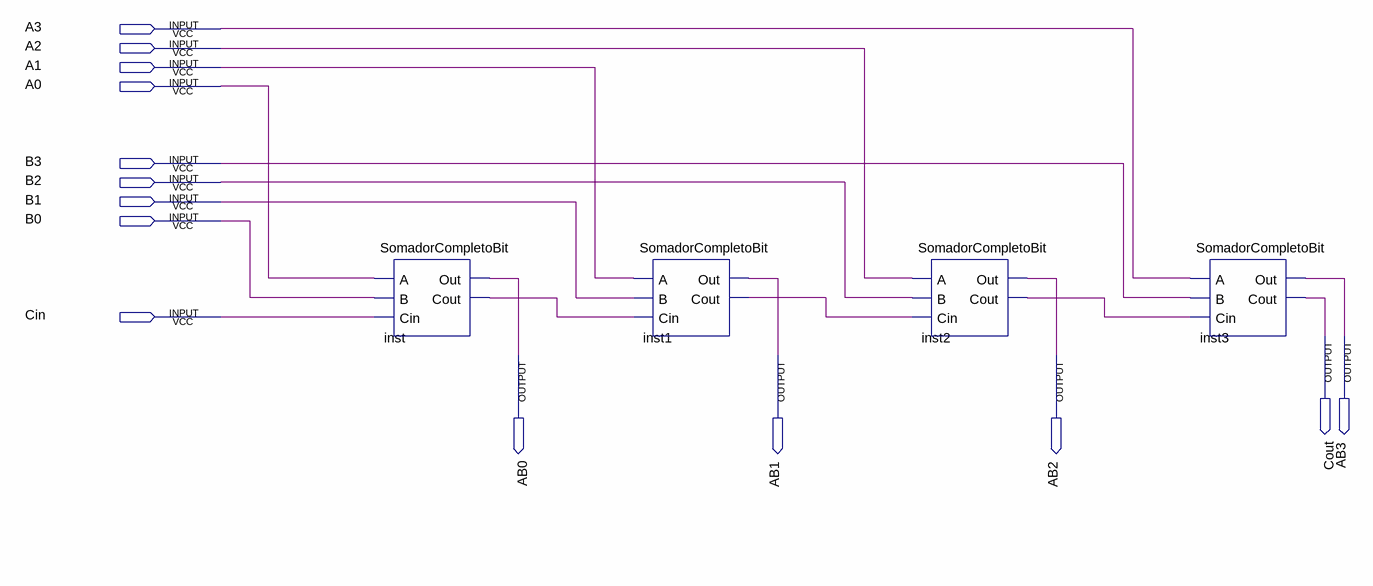
[diagram p0: schematic sheet]
// Quartus schematic SomadorCompleto.bdf as structural Verilog: 4 symbols, 14 pins
module SomadorCompleto (
  input  A3,
  input  A2,
  input  A1,
  input  A0,
  input  B3,
  input  B2,
  input  B1,
  input  B0,
  input  Cin,
  output Cout,
  output AB3,
  output AB0,
  output AB1,
  output AB2
);

  wire inst1_cout, inst2_cout, inst_cout;

  SomadorCompletoBit inst (.A(A0), .B(B0), .Cin(Cin), .Out(AB0), .Cout(inst_cout));
  SomadorCompletoBit inst1 (.A(A1), .B(B1), .Cin(inst_cout), .Out(AB1), .Cout(inst1_cout));
  SomadorCompletoBit inst2 (.A(A2), .B(B2), .Cin(inst1_cout), .Out(AB2), .Cout(inst2_cout));
  SomadorCompletoBit inst3 (.A(A3), .B(B3), .Cin(inst2_cout), .Out(AB3), .Cout(Cout));
endmodule
